# EAGLE design Receiver RF Amplifier Stage (EAGLE 9.2.2)
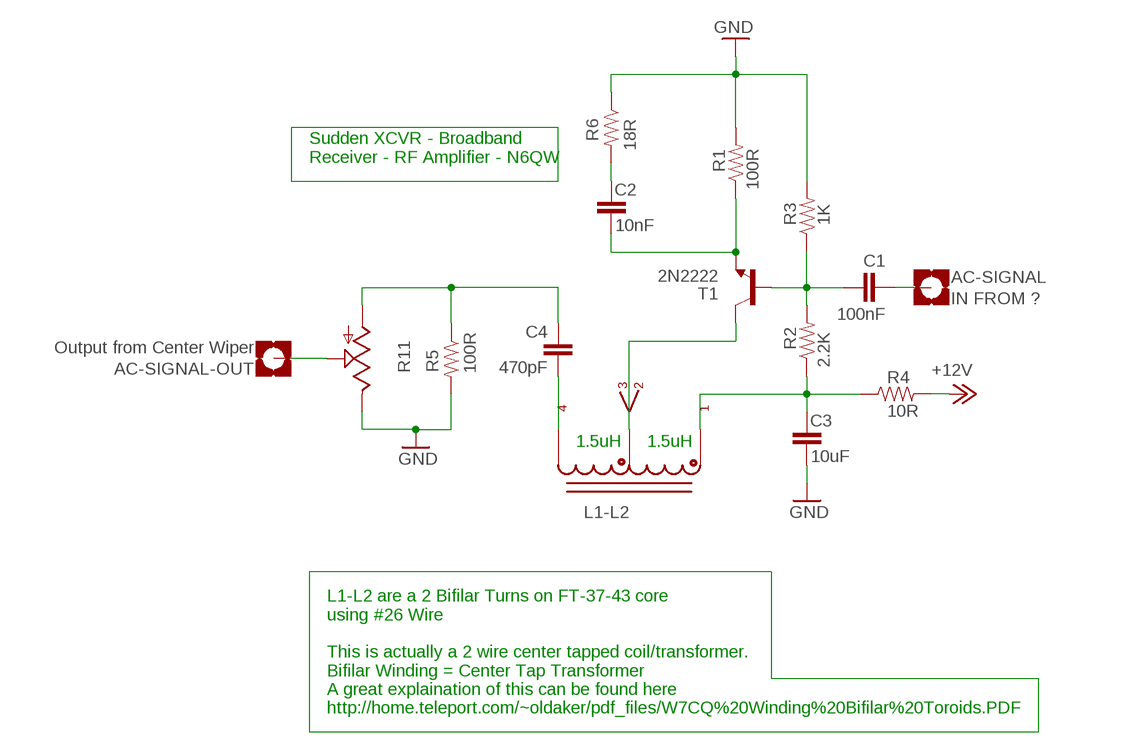
[diagram p0: schematic, sheet 1]

## Parts
AC-SIGNAL  IN FROM ?  MOUNT-PAD-SQUARE4.5  [PAD-SQUARE]
AC-SIGNAL-OUT  Output from Center Wiper  MOUNT-PAD-SQUARE4.5  [PAD-SQUARE]
C1  100nF  CAP-MEDIUM-MUPPET  [CAP-MEDIUM-MUPPET]
C2  10nF  CAP-MEDIUM-MUPPET  [CAP-MEDIUM-MUPPET]
C3  10uF  CAP-MEDIUM-MUPPET  [CAP-MEDIUM-MUPPET]
C4  470pF  CAP-MEDIUM-MUPPET  [CAP-MEDIUM-MUPPET]
L1-L2  T37-43_BIFILAR_TORIODBIFILAR-COIL/TRANSFORMER  [T37-43_BIFILAR_TOROID]
P+1  +12V  [POWER-IN-PAD]
R1  100R  RESISTOR-MUPPETMEDIUM-RESISTOR-PADS  [RESITOR-MUPPET]
R2  2.2K  RESISTOR-MUPPETMEDIUM-RESISTOR-PADS  [RESITOR-MUPPET]
R3  1K  RESISTOR-MUPPETMEDIUM-RESISTOR-PADS  [RESITOR-MUPPET]
R4  10R  RESISTOR-MUPPETMEDIUM-RESISTOR-PADS  [RESITOR-MUPPET]
R5  100R  RESISTOR-MUPPETMEDIUM-RESISTOR-PADS  [RESITOR-MUPPET]
R6  18R  RESISTOR-MUPPETMEDIUM-RESISTOR-PADS  [RESITOR-MUPPET]
R11  POTENTIOMETER-TRIMCT6  [POT-TRIMM-4]
T1  2N2222  [2N2222-TO18]

## Nets
+12V: P+1.VCC(+12V) R4.P$2
GND: C3.1 R1.P$2 R3.P$2 R5.P$2 R6.P$1 R11.E
N$1: C1.1 R2.P$2 R3.P$1 T1.2(B)
N$3: AC-SIGNAL-OUT.PAD(MOUNT) R11.S
N$4: C2.2 R6.P$2
N$5: L1-L2.C2A T1.3(C)
N$6: C4.1 L1-L2.C3A
N$7: C3.2 L1-L2.C1A R2.P$1 R4.P$1
N$8: C4.2 R5.P$1 R11.A
N$9: AC-SIGNAL.PAD(MOUNT) C1.2
N$12: C2.1 R1.P$1 T1.1(E)

## Notes on the sheet
- Sudden XCVR - Broadband
  Receiver - RF Amplifier - N6QW
- 1.5uH | 1.5uH
- L1-L2 are a 2 Bifilar Turns on FT-37-43 core
  using #26 Wire
  
  This is actually a 2 wire center tapped coil/transformer. 
  Bifilar Winding = Center Tap Transformer 
  A great explaination of this can be found here
  http://home.teleport.com/~oldaker/pdf_files/W7CQ%20Winding%20Bifilar%20Toroids.PDF

## Library data of the parts
AC-SIGNAL = jim_muppet_parts:MOUNT-PAD-SQUARE: MOUNTING PAD, square; SPICEPREFIX: A
AC-SIGNAL-OUT = jim_muppet_parts:MOUNT-PAD-SQUARE: MOUNTING PAD, square
C1-C4 = jim_muppet_parts:CAP-MEDIUM-MUPPET: Capacitor - Muppet style - Medium size SMT Pads 120 square SMT pads; PROD_ID: JIM-CAP Large SMT; VALUE: Set 0.0uF
L1-L2 = jim_muppet_parts:T37-43_BIFILAR_TORIOD: A BiFilar Cooil/Transformer on a T37-43 Toroid Bifilar Winding = Center Tap Transformer http://home.teleport.com/~oldaker/pdf_files/W7CQ%20Winding%20Bifilar%20Toroids.PDF
P+1 = jim_muppet_parts:+12V: SUPPLY SYMBOL
R1-R6 = jim_muppet_parts:RESISTOR-MUPPET: Muppet stype resitor 120 square pad; PROD_ID: MUP-RES; VALUE: ohm
R11 = jim_muppet_parts:POTENTIOMETER-TRIM: POTENTIOMETER
T1 = jim_muppet_parts:2N2222: NPN TRANSISTOR

## Net classes
0 default: width 0.94 mm, clearance 0.889 mm

## Board
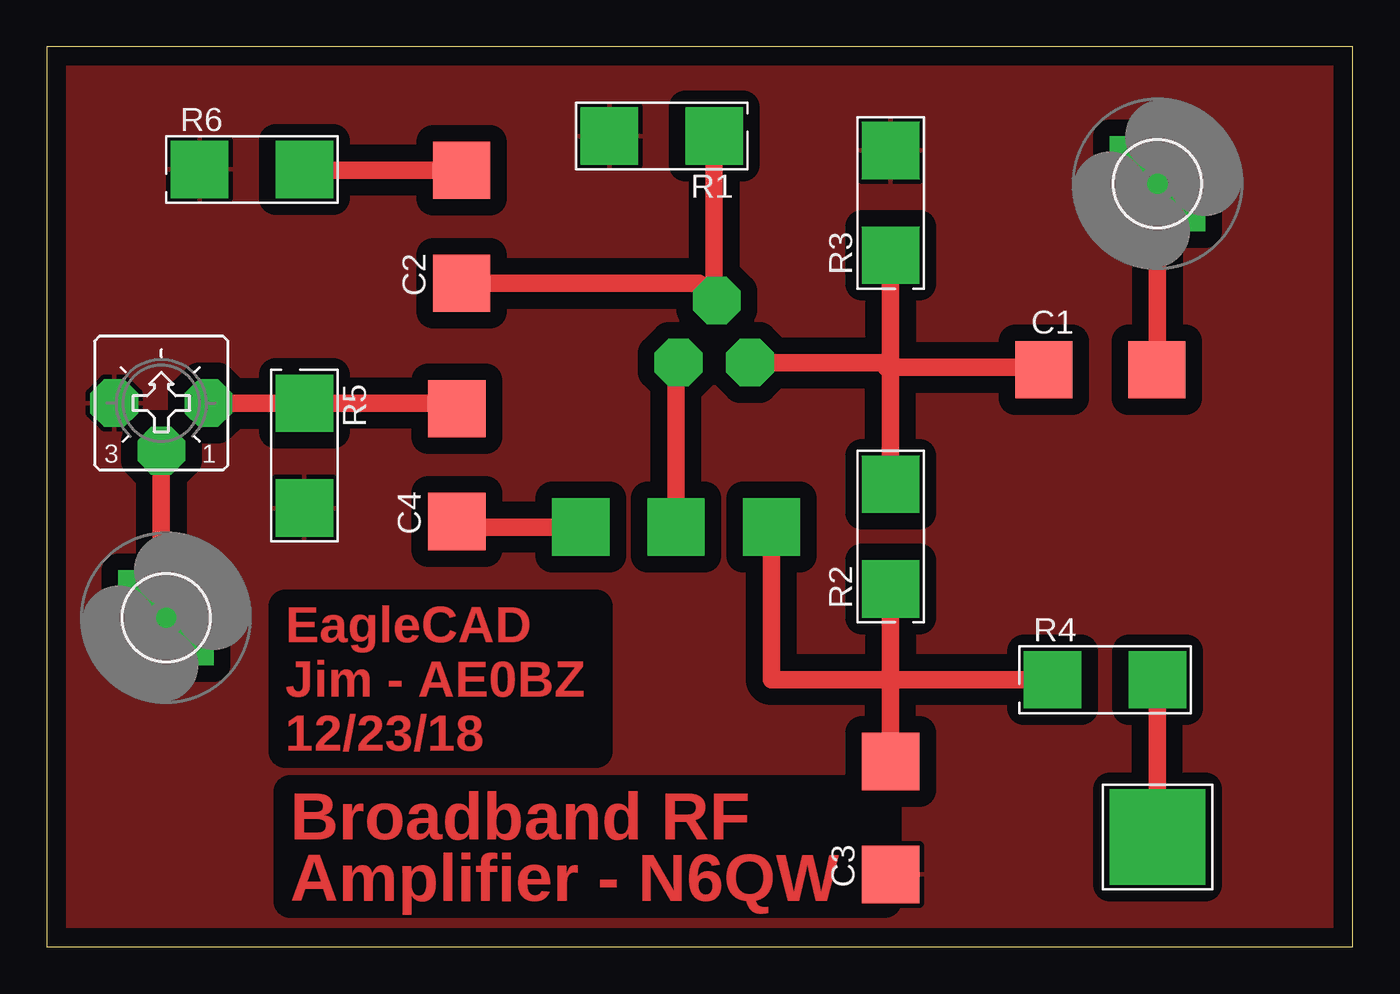
[diagram p1: board, top side]
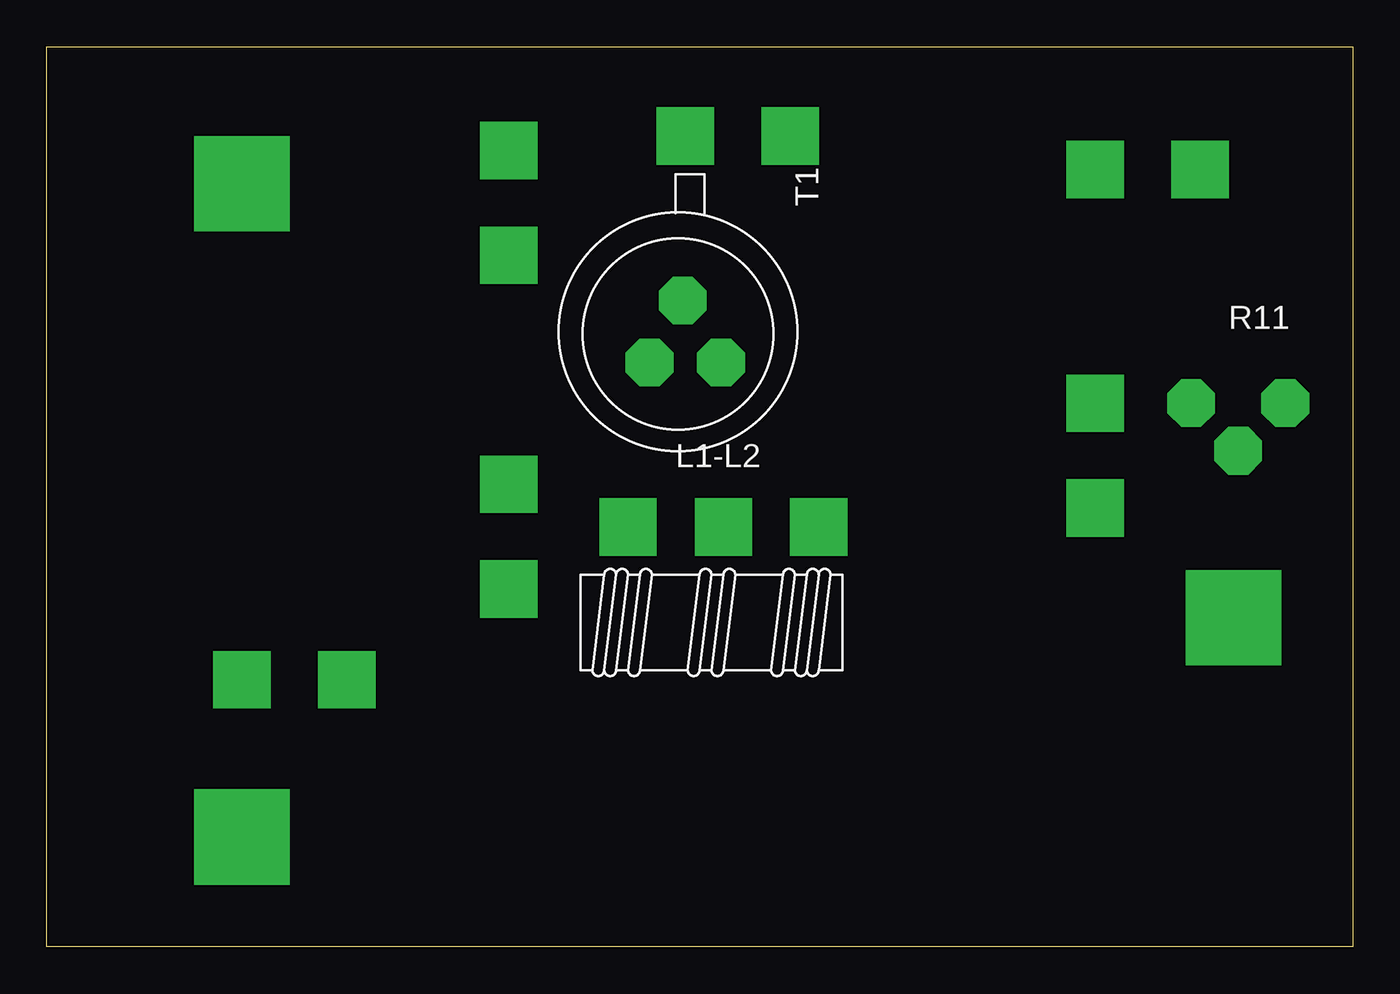
[diagram p2: board, bottom side, seen from below]

Size 69.58 x 47.93 mm. Coordinates in mm from the lower left corner, seen from the top.
Outline: 0,0 69.58,0 69.58,47.93 0,47.93 0,0
Copper layers (1*16): Top 0.035mm / dielectric 1.5mm / Bottom 0.035mm
Design rules "default": minimum track width 6mil, minimum drill 0.35mm, track to track 6mil, track to pad 6mil, pad to pad 6mil, via to via 6mil, smd to smd 6mil, copper to edge 40mil, drill to drill 6mil, minimum pad ring 10mil, minimum via ring 8mil, stop-mask expansion 4mil, vias tented up to drill 0mil, thermal gap 10mil

### Footprints (pad centres in the part's own frame; a part is rotated, then mirrored left to right if it is on the bottom)
PAD-SQUARE = drill 0 pad 5.08 square: PAD 0,0
CAP-MEDIUM-MUPPET = smd 3.048 x 3.048: 1 -3.009,0; 2 3.009,0
T37-43_BIFILAR_TOROID = drill 0 pad 3.048 square: C1A -5.08,-5.08; C2A -5.08,0; C3A -5.08,5.08
POWER-IN-PAD = drill 0 pad 5.08 square: VCC 0,0
RESITOR-MUPPET = drill 0 pad 3.048 square: P$1 -2.794,0; P$2 2.794,0
POT-TRIMM-4 = drill 0 pad 2.54 octagon: A 2.515,0; E -2.515,0; S 0,-2.54
2N2222-TO18 = drill 0 pad 2.54 octagon: 1 0.127,-0.127; 2 3.429,-1.905; 3 3.429,1.905

### Placement (x,y rotation side)
AC-SIGNAL  59.18,40.64 0 top
AC-SIGNAL-OUT  6.35,17.53 0 top
C1  56.13,30.73 0 top
C2  22.1,38.35 90 top
C3  44.96,6.86 90 top
C4  21.84,25.65 90 top
L1-L2  33.53,17.27 270 bottom
P+1  59.18,5.84 0 top
R1  32.77,43.18 180 top
R2  44.96,21.84 90 top
R3  44.96,39.62 90 top
R4  56.39,14.22 0 top
R5  13.72,26.16 270 top
R6  10.92,41.4 0 top
R11  6.1,28.96 0 top
T1  35.56,34.54 270 bottom

### Tracks (layer width: path | path; a pad name or v marks a point on that pad's centre or on a via)
+12V
  Top 0.94: P+1.VCC R4.P$2
GND
  pour Top: 0,0 0,62.23 80.26,62.23 80.26,0
N$1
  Top 0.94: 53.12,30.99 C1.1 53,30.86 44.7,30.86 44.96,30.61 | R2.P$2 44.96,30.61 | R3.P$1 44.96,31.24 | 44.96,31.24 44.96,30.61 | T1.2 44.83,31.11 44.96,31.24
N$3
  Top 0.94: R11.S 6.1,17.53 AC-SIGNAL-OUT.PAD
N$4
  Top 0.94: 21.9,41.56 C2.2 13.76,41.36 R6.P$2
N$5
  Top 0.94: L1-L2.C2A 33.53,31.11 T1.3
N$6
  Top 0.94: C4.1 22.14,22.35 L1-L2.C3A
N$7
  Top 0.152: 44.96,19.3 R2.P$1
  Top 0.94: R2.P$1 44.96,14.22 | 44.96,9.4 C3.2 44.96,14.22 | R4.P$1 44.96,14.22 | 44.96,14.22 38.61,14.22 L1-L2.C1A
N$8
  Top 0.152: 21.84,28.45 C4.2
  Top 0.94: 21.84,28.19 C4.2 21.84,28.96 R5.P$1 | R5.P$1 13.72,28.7 | 14.19,29.43 R5.P$1 | R11.A R5.P$1
N$9
  Top 0.94: AC-SIGNAL.PAD 59.18,30.77 C1.2
N$12
  Top 0.94: 22.1,35.43 C2.1 | C2.1 22.3,35.34 | C2.1 34.76,35.34 T1.1 35.56,34.54 R1.P$1

### Text on the board
Top: EagleCAD / Jim - AE0BZ / 12/23/18 | Broadband RF / Amplifier - N6QW